# Altium schematic sheet 氧传感器.SchDoc
size A4
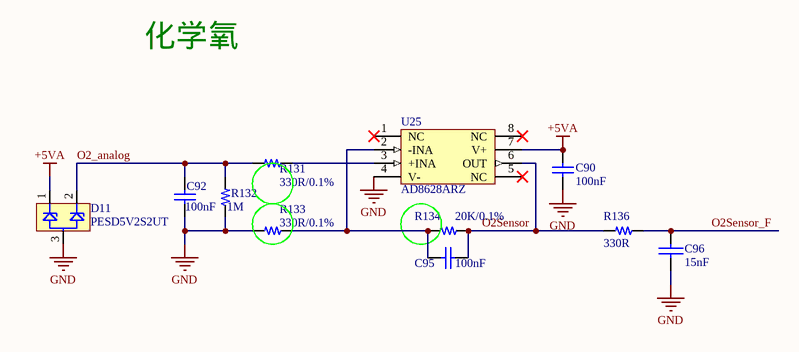
[diagram p0: 氧传感器.SchDoc]

## Parts
C90  100nF  [C-0603]
C92  100nF  [C-0603]
C95  100nF  [C-0603]
C96  15nF  [C-0603]
D11  PESD5V2S2UT  [sot23-3]
R131  330R/0.1%  [R-0603]
R132  1M  [R-0603]
R133  330R/0.1%  [R-0603]
R134  20K/0.1%  [R-0603]
R136  330R  [R-0603]
U25  AD8628ARZ  [SOIC8]

## Nets
+5VA: C90.1 D11.1 U25.7(V+)
GND: C90.2 C92.1 C96.1 D11.3 R132.1(TOP) R133.1(TOP) U25.4(V-)
O2_analog: C92.2 D11.2 R131.1(TOP) R132.2(BOT)
O2Sensor: C95.2 R134.2(BOT) R136.2 U25.6(OUT)
O2Sensor_F: C96.2 R136.1
NetC95_1: C95.1 R133.2(BOT) R134.1(TOP) U25.2(-INA)
NetR131_2: R131.2(BOT) U25.3(+INA)

Not connected (* = marked no-connect by the designer): U25 1(NC)* 5(NC)* 8(NC)*

## Notes on the sheet
- 化学氧

## Library data of the parts
C90 C92 C95 = 100nF_1: 贴片瓷介电容100nF±5%,0805; 物料编号: 210001894; 详细描述: X7R,50V,三星CL21B104JBCNNNC; 版本: V1.00; 制造商: 三星; 名称: 贴片瓷介电容100nF±5%,0805
C96 = CAP: Capacitor
D11 = PESDxS2UT
R131 R133 = 330Ω_1: 国巨RC0805FR-07330R; 物料编号: 210000706; 详细描述: 0805,1/8W,国巨RC0805FR-07330R; 制造商: 国巨; 版本: V1.00; 名称: 贴片电阻330±1%
R132 = 1M_1: 国巨RC0805FR-071M; 物料编号: 210000749; 详细描述: 0805,1/8W,国巨RC0805FR-071M; 制造商: 国巨; 版本: V1.00; 名称: 贴片电阻1M±1%
R134 = 12K_1: 国巨RC0805FR-0712K; 物料编号: 210000764; 详细描述: 0805,1/8W,国巨RC0805FR-0712K; 制造商: 国巨; 版本: V1.00; 名称: 贴片电阻12K±1%
R136 = R-0603
U25 = AD8628ARZ: 版本: V1.00; 名称: 芯片AD8628ARZ; 物料编号: 210001135; 详细描述: 精密运放AD8628ARZ ,SOIC8,-40℃+125℃; 制造商: ADI